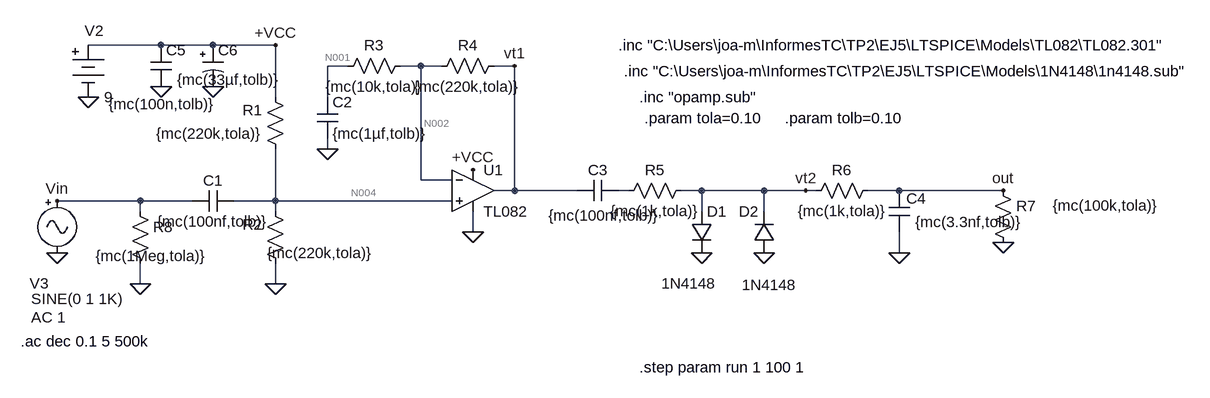
[diagram p0: schematic punto 5 senoidemontecarlo.asc]
punto 5 senoidemontecarlo.asc, the LTspice schematic file:
Version 4
SHEET 1 1528 680
WIRE -352 -80 -464 -80
WIRE -272 -80 -352 -80
WIRE -176 -80 -272 -80
WIRE -64 -48 -96 -48
WIRE 48 -48 16 -48
WIRE 80 -48 48 -48
WIRE 192 -48 160 -48
WIRE -176 0 -176 -80
WIRE -96 0 -96 -48
WIRE -96 80 -96 64
WIRE 48 128 48 -48
WIRE 96 128 48 128
WIRE 192 144 192 -48
WIRE 192 144 160 144
WIRE 288 144 192 144
WIRE 368 144 352 144
WIRE 480 144 448 144
WIRE 576 144 480 144
WIRE 640 144 576 144
WIRE 656 144 640 144
WIRE 784 144 736 144
WIRE 944 144 784 144
WIRE -384 160 -512 160
WIRE -304 160 -384 160
WIRE -176 160 -176 80
WIRE -176 160 -240 160
WIRE 96 160 -176 160
WIRE -384 176 -384 160
WIRE -176 176 -176 160
WIRE 480 176 480 144
WIRE 576 176 576 144
WIRE 128 208 128 176
WIRE 784 240 784 208
WIRE -384 288 -384 256
WIRE -176 288 -176 256
FLAG -96 80 0
FLAG 784 240 0
FLAG 128 208 0
FLAG -176 288 0
FLAG -352 -16 0
FLAG -384 288 0
FLAG -512 240 0
FLAG -464 0 0
FLAG -512 160 Vin
FLAG -176 -80 +VCC
FLAG 128 112 +VCC
FLAG -272 -16 0
FLAG 192 -48 vt1
FLAG 640 144 vt2
FLAG 944 144 out
FLAG 480 240 0
FLAG 576 240 0
FLAG 944 224 0
SYMBOL res -160 96 R180
WINDOW 0 36 76 Left 2
WINDOW 3 36 40 Left 2
SYMATTR InstName R1
SYMATTR Value {mc(220k,tola)}
SYMBOL res -160 272 R180
WINDOW 0 36 76 Left 2
WINDOW 3 -135 32 Left 2
SYMATTR InstName R2
SYMATTR Value {mc(220k,tola)}
SYMBOL res -80 -32 R270
WINDOW 0 32 56 VTop 2
WINDOW 3 0 56 VBottom 2
SYMATTR InstName R3
SYMATTR Value {mc(10k,tola)}
SYMBOL res 176 -64 R90
WINDOW 0 0 56 VBottom 2
WINDOW 3 32 57 VTop 2
SYMATTR InstName R4
SYMATTR Value {mc(220k,tola)}
SYMBOL res 464 128 R90
WINDOW 0 0 56 VBottom 2
WINDOW 3 32 56 VTop 2
SYMATTR InstName R5
SYMATTR Value {mc(1k,tola)}
SYMBOL cap -240 144 R90
WINDOW 0 0 32 VBottom 2
WINDOW 3 32 32 VTop 2
SYMATTR InstName C1
SYMATTR Value {mc(100nf,tolb)}
SYMBOL cap 768 144 R0
WINDOW 0 27 12 Left 2
WINDOW 3 41 48 Left 2
SYMATTR InstName C4
SYMATTR Value {mc(3.3nf,tolb)}
SYMBOL res -400 160 R0
WINDOW 3 -53 85 Left 2
SYMATTR InstName R8
SYMATTR Value {mc(1Meg,tola)}
SYMBOL Misc\\battery -464 -96 R0
WINDOW 123 0 0 Left 2
WINDOW 39 0 0 Left 2
WINDOW 0 -6 -6 Left 2
SYMATTR InstName V2
SYMATTR Value 9
SYMBOL Misc\\signal -512 144 R0
WINDOW 123 -40 195 Left 2
WINDOW 39 0 0 Left 2
WINDOW 0 -42 143 Left 2
WINDOW 3 -40 167 Left 2
SYMATTR Value2 AC 1
SYMATTR InstName V3
SYMBOL res 752 128 R90
WINDOW 0 0 56 VBottom 2
WINDOW 3 32 56 VTop 2
SYMATTR InstName R6
SYMATTR Value {mc(1k,tola)}
SYMBOL cap -368 -80 R0
WINDOW 3 -65 91 Left 2
SYMATTR Value {mc(100n,tolb)}
SYMATTR InstName C5
SYMBOL polcap -288 -80 R0
WINDOW 3 -39 53 Left 2
SYMATTR Value {mc(33µf,tolb)}
SYMATTR InstName C6
SYMBOL res 928 128 R0
WINDOW 3 92 39 Left 2
SYMATTR Value {mc(100k,tola)}
SYMATTR InstName R7
SYMBOL cap -112 0 R0
SYMATTR InstName C2
SYMATTR Value {mc(1µf,tolb)}
SYMBOL Opamps\\opamp2 128 80 R0
SYMATTR InstName U1
SYMATTR Value TL082
SYMATTR SpiceModel TL082
SYMBOL cap 352 128 R90
WINDOW 0 0 32 VBottom 2
WINDOW 3 39 22 VTop 2
SYMATTR InstName C3
SYMATTR Value {mc(100nf,tolb)}
SYMBOL diode 464 176 R0
WINDOW 3 -46 111 Left 2
SYMATTR Value 1N4148
SYMATTR InstName D1
SYMBOL diode 592 240 R180
WINDOW 0 24 64 Left 2
WINDOW 3 -35 -49 Left 2
SYMATTR InstName D2
SYMATTR Value 1N4148
TEXT 352 -80 Left 2 !.inc "C:\\Users\\joa-m\\InformesTC\\TP2\\EJ5\\LTSPICE\\Models\\TL082\\TL082.301"
TEXT 360 -40 Left 2 !.inc "C:\\Users\\joa-m\\InformesTC\\TP2\\EJ5\\LTSPICE\\Models\\1N4148\\1n4148.sub"
TEXT 384 0 Left 2 !.inc "opamp.sub"
TEXT -568 376 Left 2 !.ac dec 0.1 5 500k
TEXT 392 32 Left 2 !.param tola=0.10
TEXT 608 32 Left 2 !.param tolb=0.10
TEXT 384 416 Left 2 !.step param run 1 100 1

The netlist it stands for:
* punto 5 senoidemontecarlo.asc
R1 N004 +VCC {mc(220k,tola)}
R2 0 N004 {mc(220k,tola)}
R3 N001 N002 {mc(10k,tola)}
R4 vt1 N002 {mc(220k,tola)}
R5 vt2 N003 {mc(1k,tola)}
C1 N004 Vin {mc(100nf,tolb)}
C4 out 0 {mc(3.3nf,tolb)}
R8 Vin 0 {mc(1Meg,tola)}
V2 +VCC 0 9
V3 Vin 0 SINE(0 1 1K) AC 1
R6 out vt2 {mc(1k,tola)}
C5 +VCC 0 {mc(100n,tolb)}
C6 +VCC 0 {mc(33µf,tolb)}
R7 out 0 {mc(100k,tola)}
C2 N001 0 {mc(1µf,tolb)}
XU1 N004 N002 +VCC 0 vt1 TL082 TL082  ; pins In+ In- V+ V- OUT
C3 N003 vt1 {mc(100nf,tolb)}
D1 vt2 0 1N4148
D2 0 vt2 1N4148
.model D D
.lib standard.dio
.inc "C:\Users\joa-m\InformesTC\TP2\EJ5\LTSPICE\Models\TL082\TL082.301"
.inc "C:\Users\joa-m\InformesTC\TP2\EJ5\LTSPICE\Models\1N4148\1n4148.sub"
.inc "opamp.sub"
.ac dec 0.1 5 500k
.param tola=0.10
.param tolb=0.10
.step param run 1 100 1
.backanno
.end

* Results of the author's LTspice run, read from the files saved beside the schematic
* Operating Point (first step), zero values left out:
*   run = 1 
*   V(n004) = 4.765 V
*   V(+vcc) = 9 V
*   V(n001) = 4.765 V
*   V(n002) = 4.765 V
*   V(vt1) = 4.765 V
*   I(R4) = 34.82 pA
*   I(R2) = -21.39 µA
*   I(R1) = -21.39 µA
*   I(V2) = -4.416 mA
*   Ix(u1:1) = 34.82 pA
*   Ix(u1:2) = 34.82 pA
*   Ix(u1:3) = 4.395 mA
*   Ix(u1:4) = -4.395 mA
*   Ix(u1:5) = -34.82 pA
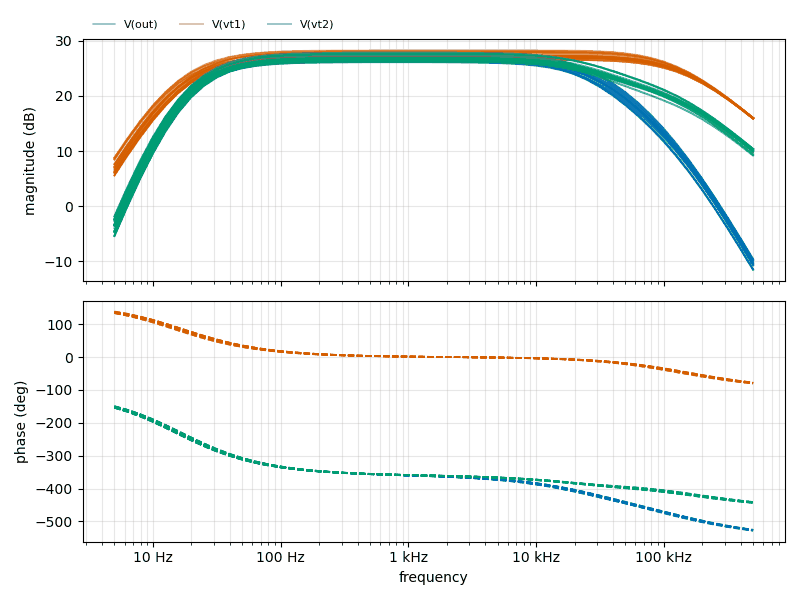
[diagram p1: AC Analysis of punto 5 senoidemontecarlo.asc, plotted from the saved traces]
* AC Analysis, 100 runs:
*   V(out) [run 1]: -2.48 dB at 5 Hz, -10.40 dB at 500 kHz, peak 27.82 dB at 792.4 Hz, 3 dB below the peak at 30.1 Hz and 24.53 kHz
*   V(out) [run 2]: -3.99 dB at 5 Hz, -10.54 dB at 500 kHz, peak 26.89 dB at 792.4 Hz, 3 dB below the peak at 30.9 Hz and 24.5 kHz
*   V(out) [run 3]: -4.69 dB at 5 Hz, -9.90 dB at 500 kHz, peak 26.84 dB at 792.4 Hz, 3 dB below the peak at 31.53 Hz and 26.37 kHz
*   V(out) [run 4]: -3.53 dB at 5 Hz, -10.36 dB at 500 kHz, peak 26.55 dB at 792.4 Hz, 3 dB below the peak at 29.91 Hz and 25.25 kHz
*   V(out) [run 5]: -3.25 dB at 5 Hz, -10.61 dB at 500 kHz, peak 26.79 dB at 792.4 Hz, 3 dB below the peak at 29.83 Hz and 24.36 kHz
*   V(out) [run 6]: -2.71 dB at 5 Hz, -10.59 dB at 500 kHz, peak 26.89 dB at 792.4 Hz, 3 dB below the peak at 29.34 Hz and 24.44 kHz
*   V(out) [run 7]: -2.38 dB at 5 Hz, -10.31 dB at 500 kHz, peak 27.72 dB at 792.4 Hz, 3 dB below the peak at 30.2 Hz and 25 kHz
*   V(out) [run 8]: -3.52 dB at 5 Hz, -10.55 dB at 500 kHz, peak 26.13 dB at 792.4 Hz, 3 dB below the peak at 29.33 Hz and 24.8 kHz
*   V(vt1) [run 1]: 7.56 dB at 5 Hz, 16.04 dB at 500 kHz, peak 28.26 dB at 2.506 kHz, 3 dB below the peak at 24.55 Hz and 128.2 kHz
*   V(vt1) [run 2]: 7.08 dB at 5 Hz, 15.99 dB at 500 kHz, peak 27.36 dB at 3.155 kHz, 3 dB below the peak at 24.15 Hz and 141.5 kHz
*   V(vt1) [run 3]: 6.32 dB at 5 Hz, 15.94 dB at 500 kHz, peak 27.31 dB at 3.155 kHz, 3 dB below the peak at 25.01 Hz and 141.9 kHz
*   V(vt1) [run 4]: 7.27 dB at 5 Hz, 15.91 dB at 500 kHz, peak 27.00 dB at 3.972 kHz, 3 dB below the peak at 23.31 Hz and 146.8 kHz
*   V(vt1) [run 5]: 7.19 dB at 5 Hz, 15.95 dB at 500 kHz, peak 27.24 dB at 3.155 kHz, 3 dB below the peak at 23.72 Hz and 143 kHz
*   V(vt1) [run 6]: 7.07 dB at 5 Hz, 15.93 dB at 500 kHz, peak 27.33 dB at 3.972 kHz, 3 dB below the peak at 23.99 Hz and 141.1 kHz
*   V(vt1) [run 7]: 8.70 dB at 5 Hz, 16.01 dB at 500 kHz, peak 28.19 dB at 2.506 kHz, 3 dB below the peak at 23.19 Hz and 128.9 kHz
*   V(vt1) [run 8]: 6.49 dB at 5 Hz, 15.90 dB at 500 kHz, peak 26.58 dB at 5 kHz, 3 dB below the peak at 23.71 Hz and 154.9 kHz
*   V(vt2) [run 1]: -2.39 dB at 5 Hz, 10.23 dB at 500 kHz, peak 27.91 dB at 792.4 Hz, 3 dB below the peak at 30.11 Hz and 34.87 kHz
*   V(vt2) [run 2]: -3.90 dB at 5 Hz, 10.27 dB at 500 kHz, peak 26.98 dB at 997.6 Hz, 3 dB below the peak at 30.91 Hz and 35.74 kHz
*   V(vt2) [run 3]: -4.62 dB at 5 Hz, 9.85 dB at 500 kHz, peak 26.92 dB at 997.6 Hz, 3 dB below the peak at 31.54 Hz and 36.76 kHz
*   V(vt2) [run 4]: -3.44 dB at 5 Hz, 9.96 dB at 500 kHz, peak 26.64 dB at 792.4 Hz, 3 dB below the peak at 29.92 Hz and 35.77 kHz
*   V(vt2) [run 5]: -3.17 dB at 5 Hz, 9.61 dB at 500 kHz, peak 26.87 dB at 792.4 Hz, 3 dB below the peak at 29.84 Hz and 33.25 kHz
*   V(vt2) [run 6]: -2.63 dB at 5 Hz, 10.11 dB at 500 kHz, peak 26.97 dB at 792.4 Hz, 3 dB below the peak at 29.35 Hz and 35.15 kHz
*   V(vt2) [run 7]: -2.29 dB at 5 Hz, 10.39 dB at 500 kHz, peak 27.82 dB at 997.6 Hz, 3 dB below the peak at 30.2 Hz and 36.29 kHz
*   V(vt2) [run 8]: -3.44 dB at 5 Hz, 10.23 dB at 500 kHz, peak 26.21 dB at 792.4 Hz, 3 dB below the peak at 29.33 Hz and 36.65 kHz